# EAGLE design Windsensor5 (EAGLE 5.07)
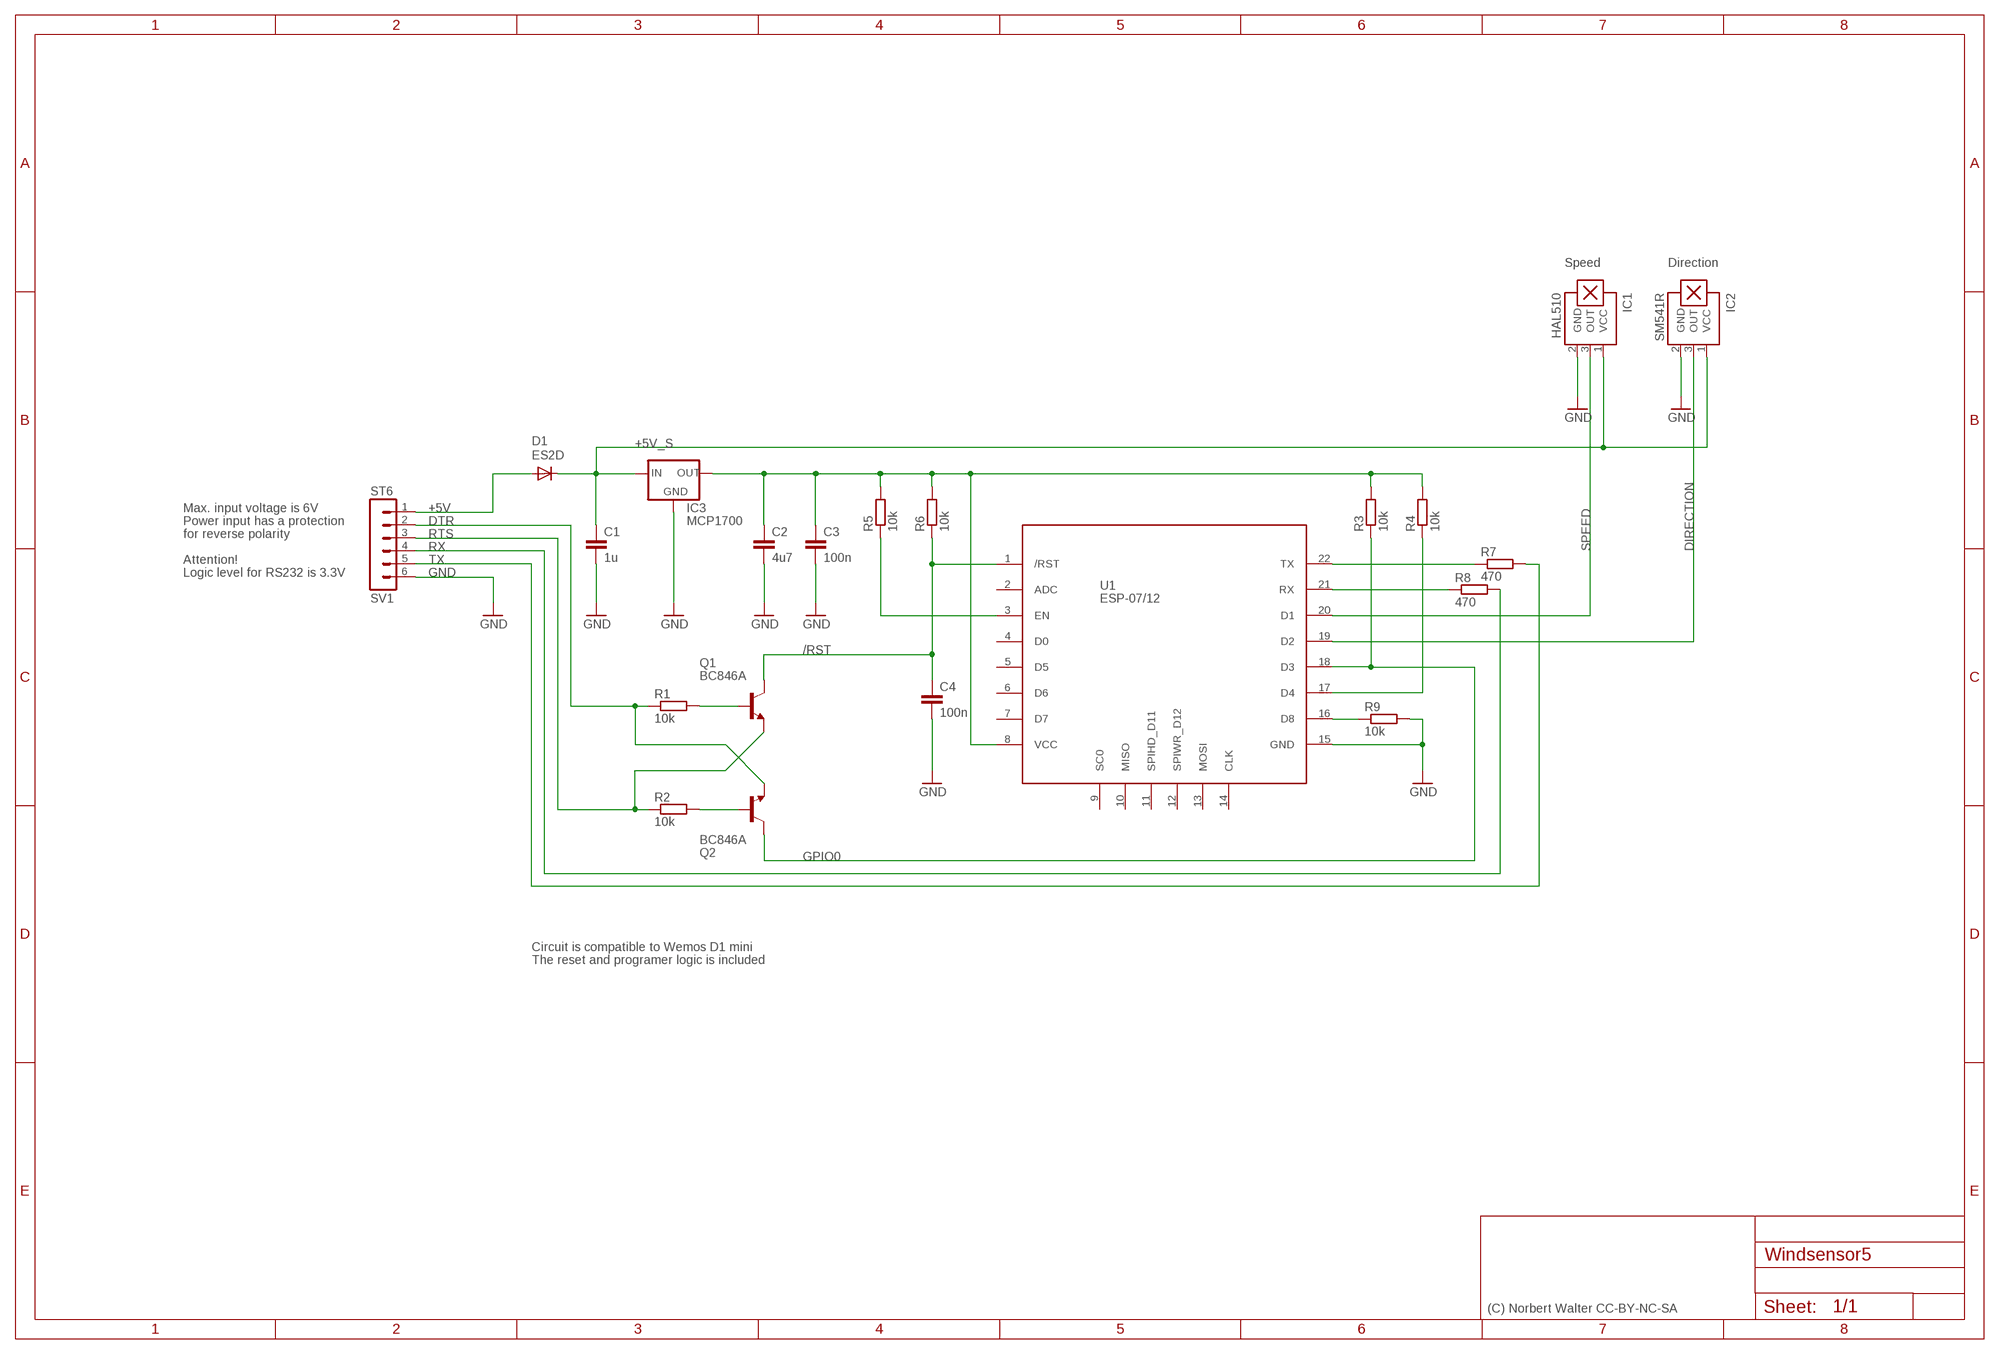
[diagram p0: schematic, sheet 1]

## Parts
C1  1u  C-EUC0805  [C0805]
C2  4u7  C-EUC0805  [C0805]
C3  100n  C-EUC0805K  [C0805K]
C4  100n  C-EUC0805K  [C0805K]
D1  ES2D  [SMB]
IC1  HAL510  A1301UA  [SIP3-UA]
IC2  SM541R  [SIP3-UA]
IC3  MCP1700  [SOT223]
Q1  BC846A  BC849SMD  [SOT23-BEC]
Q2  BC846A  BC849SMD  [SOT23-BEC]
R1  10k  R-EU_M0805  [M0805]
R2  10k  R-EU_M0805  [M0805]
R3  10k  R-EU_M0805  [M0805]
R4  10k  R-EU_M0805  [M0805]
R5  10k  R-EU_M0805  [M0805]
R6  10k  R-EU_M0805  [M0805]
R7  470  R-EU_M0805  [M0805]
R8  470  R-EU_M0805  [M0805]
R9  10k  R-EU_M0805  [M0805]
SV1  ST6  MA06-1  [MA06-1]
U1  ESP-07/12  [ESP-07/12]

## Nets
+3.3V: C2.1 C3.1 IC3.3(OUT) R3.2 R4.2 R5.2 R6.2 U1.8(VCC)
+5V: D1.A SV1.1
+5V_S: C1.1 D1.C IC1.1(VCC) IC2.1(VCC) IC3.2(IN)
/RST: C4.1 Q1.C R6.1 U1.1(/RST)
DIRECTION: IC2.3(OUT) U1.19(D2)
DTR: Q2.E R1.1 SV1.2
GND: C1.2 C2.2 C3.2 C4.2 IC1.2(GND) IC2.2(GND) IC3.1(GND) R9.2 SV1.6 U1.15(GND)
GPIO0: Q2.C R3.1 U1.18(D3)
N$4: R5.1 U1.3(EN)
N$5: R9.1 U1.16(D8)
N$6: R8.1 U1.21(RX)
N$7: R7.1 U1.22(TX)
N$8: Q1.B R1.2
N$9: Q2.B R2.2
N$16: R4.1 U1.17(D4)
RTS: Q1.E R2.1 SV1.3
RX: R8.2 SV1.4
SPEED: IC1.3(OUT) U1.20(D1)
TX: R7.2 SV1.5
Unconnected: U1.2(ADC) U1.4(D0) U1.5(D5) U1.6(D6) U1.7(D7) U1.9(SC0) U1.10(MISO) U1.11(SPIHD_D11) U1.12(SPIWR_D12) U1.13(MOSI) U1.14(CLK)

## Notes on the sheet
- Speed | Direction
- Max. input voltage is 6V
- Power input has a protection
- for reverse polarity
- Attention!
- Logic level for RS232 is 3.3V
- Circuit is compatible to Wemos D1 mini
- The reset and programer logic is included
- (C) Norbert Walter CC-BY-NC-SA

## Library data of the parts
C1-C4 = rcl:C-EU: CAPACITOR, European symbol
D1 = diode:ES2D: DIODE super fast rectifier, 2 A
IC1 = allegro:A13*?: Linear Hall Effect Sensor ICs Continuous-Time Ratiometric High-Temperature Operation Programmable Linear with Analog Output A1302 -Replacement- UGN3503 Source: http://www.allegromicro.com/en/Products/Part_Numbers/1301/1301.pdf http://www.allegromicro.com/en/Products/Part_Numbers/1321/1321.pdf http://www.allegromicro.com/en/Products/Part_Numbers/1381/1381.pdf
IC2 = allegro:SM541R
IC3 = v-reg:MCP1700
Q1 Q2 = transistor-npn:BC849*: NPN Transistor
R1-R9 = resistor:R-EU_: RESISTOR, European symbol
SV1 = con-lstb:MA06-1: PIN HEADER
U1 = ESP-12E:ESP-07/12: Version 1.0 of the library for the ESP-07/12 full GPIO dev board module byME Jon jonnyradu@gmail.com

## Board
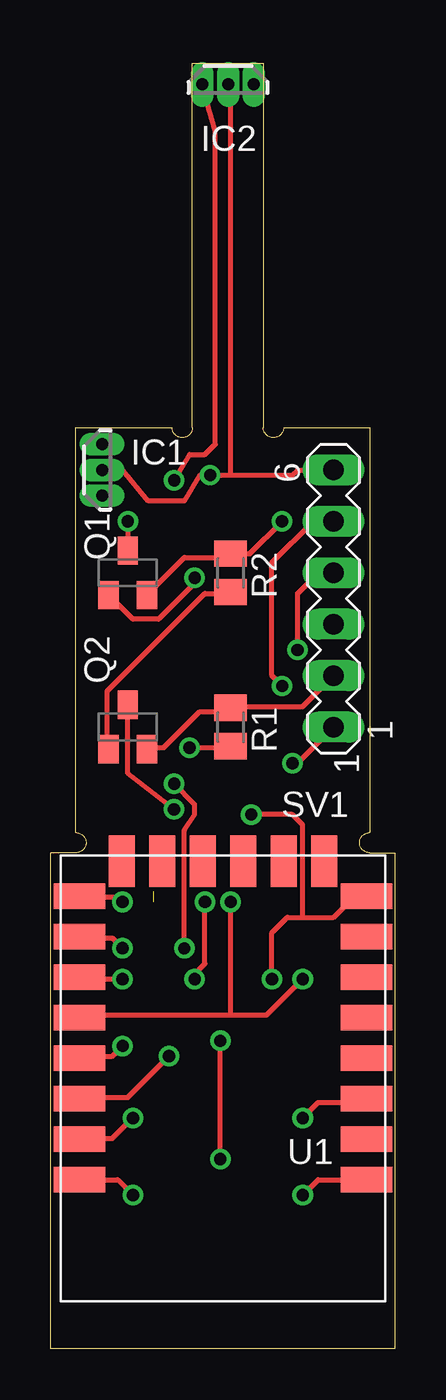
[diagram p1: board, top side]
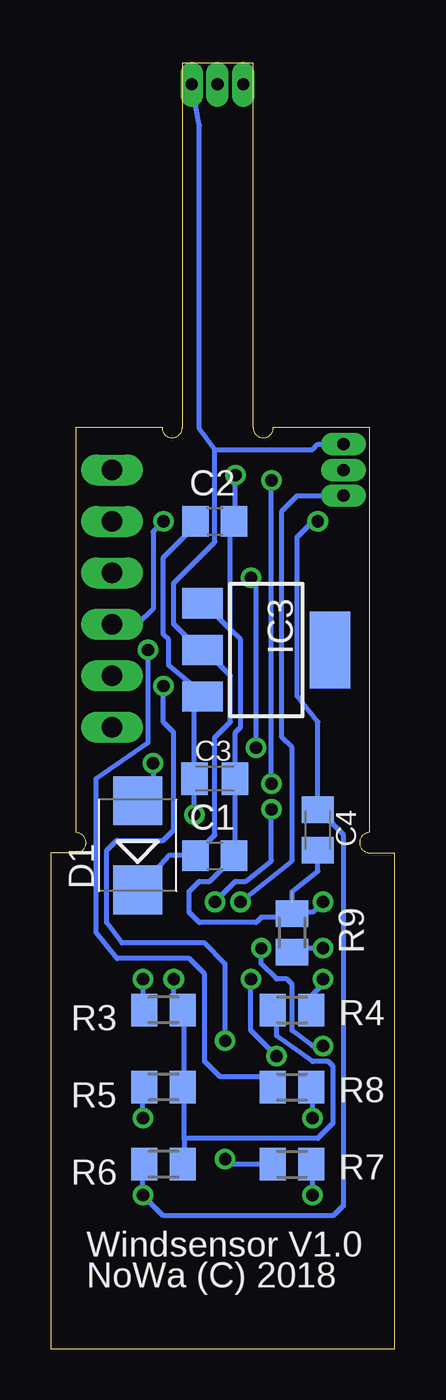
[diagram p2: board, bottom side, seen from below]

Size 17 x 63.5 mm. Coordinates in mm from the lower left corner, seen from the top.
Outline: 0,0 0,24.5 1.25,24.5 arc180 1.25,25.5 1.25,45.5 6,45.5 arc180 7,45.5 7,63.5 10.5,63.5 10.5,45.5 arc180 11.5,45.5 15.75,45.5 15.75,25.5 arc180 15.75,24.5 17,24.5 17,0 0,0
Copper layers (1*16): Top 0.035mm / dielectric 1.5mm / Bottom 0.035mm
Design rules "default *": minimum track width 10mil, minimum drill 24mil, track to track 5mil, track to pad 5mil, pad to pad 5mil, via to via 5mil, smd to smd 5mil, copper to edge 12mil, drill to drill 8mil, minimum pad ring 10mil, minimum via ring 8mil, stop-mask expansion 4mil, vias tented up to drill 0mil, thermal gap 10mil

### Footprints (pad centres in the part's own frame; a part is rotated, then mirrored left to right if it is on the bottom)
C0805 = smd 1.3 x 1.5: 1 -0.95,0; 2 0.95,0
C0805K = smd 1.3 x 1.6: 1 -1,0; 2 1,0
SMB = smd 2.4 x 2.4: A 2.2,0; C -2.2,0
SIP3-UA = drill 0.6 pad 0.7 long: 1 -1.27,0; 2 0,0; 3 1.27,0
SOT223 = smd 1.5 x 2: 1 -2.3,-3.15; 2 0,-3.15; 3 2.3,-3.15 | smd 3.8 x 2: 4 0,3.15
SOT23-BEC = smd 1 x 1.4: B -0.95,-1.1; C 0,1.1; E 0.95,-1.1
M0805 = smd 1.3 x 1.6: 1 -0.95,0; 2 0.95,0
MA06-1 = drill 1.016 long: 1 -6.35,0; 2 -3.81,0; 3 -1.27,0; 4 1.27,0; 5 3.81,0; 6 6.35,0
ESP-07/12 = smd 2.54 x 1.27: 1 -6.715,7.11; 2 -6.715,5.11; 3 -6.715,3.11; 4 -6.715,1.11; 5 -6.715,-0.89; 6 -6.715,-2.89; 7 -6.715,-4.89; 8 -6.715,-6.89; 15 7.475,-6.89; 16 7.475,-4.89; 17 7.475,-2.89; 18 7.475,-0.89; 19 7.475,1.11; 20 7.475,3.11; 21 7.475,5.11; 22 7.475,7.11 | smd 1.27 x 2.54: 9 -4.62,-8.62; 10 -2.62,-8.62; 11 -0.62,-8.62; 12 1.38,-8.62; 13 3.38,-8.62; 14 5.38,-8.62

### Placement (x,y rotation side)
C1  8.89,24.36 0 bottom
C2  8.89,40.87 0 bottom
C3  8.89,28.17 0 bottom
C4  3.81,25.63 270 bottom
D1  12.7,24.87 90 bottom
IC1  2.54,43.41 270 top
IC2  8.76,62.46 180 top
IC3  6.35,34.52 270 bottom
Q1  3.81,38.33 0 top
Q2  3.81,30.71 0 top
R1  8.89,30.71 270 top
R2  8.89,38.33 270 top
R3  11.43,16.74 0 bottom
R4  5.08,16.74 180 bottom
R5  11.43,12.93 0 bottom
R6  11.43,9.12 0 bottom
R7  5.08,9.12 180 bottom
R8  5.08,12.93 180 bottom
R9  5.08,20.55 90 bottom
SV1  13.97,37.06 90 top
U1  8.89,15.47 180 top

### Tracks (layer width: path | path; a pad name or v marks a point on that pad's centre or on a via)
+3.3V  (via drill 0.61)
  Top 0.254: v9.91,26.39 11.94,26.39 12.45,25.88 12.45,21.31 | v10.92,18.26 10.92,20.55 11.68,21.31 12.45,21.31 | U1.8 15.49,22.33 14.99,22.33 13.97,21.31 12.45,21.31
  Bottom 0.254: 9.91,28.17 9.91,31.98 IC3.3 9.65,32.49 11.18,33.76 11.18,35.03 11.43,35.28 11.43,39.09 9.91,40.62 9.91,40.87 C2.1 | 10.41,10.39 3.81,10.39 3.05,11.15 3.05,13.95 3.3,14.2 4.06,14.2 5.84,15.47 5.84,16.74 R4.2 | 10.41,10.39 10.41,9.12 R6.2 | v10.92,18.26 10.92,16.99 10.67,16.74 R3.2 10.41,16.74 10.41,12.93 R5.2 10.41,12.17 10.41,10.39 | v9.91,26.39 9.91,28.17 | 9.91,28.17 C3.1
+5V  (via drill 0.61)
  Top 0.254: v11.94,28.93 12.19,28.93 SV1.1
  Bottom 0.254: v11.94,28.93 11.94,27.92 D1.A
+5V_S
  Bottom 0.254: 9.91,24.36 11.18,24.36 D1.C | 9.91,24.36 8.89,25.38 8.89,30.2 8.13,30.96 8.13,33.25 9.4,34.52 IC3.2 9.65,34.52 10.92,35.79 10.92,37.82 8.89,39.85 8.89,44.43 | C1.1 9.91,24.36 | IC1.1 3.81,44.68 4.06,44.43 8.89,44.43 | 8.89,44.43 9.65,45.44 9.65,60.43 IC2.1
/RST  (via drill 0.61)
  Top 0.254: v12.45,7.6 13.21,8.36 15.49,8.36 U1.1 | v3.81,40.87 Q1.C 3.81,39.35
  Bottom 0.254: R6.1 12.45,9.12 v12.45,7.6 11.43,6.58 3.05,6.58 2.54,7.09 2.54,25.38 3.81,26.65 | v3.81,40.87 4.06,40.87 4.83,40.11 4.83,32.23 3.81,30.96 3.81,26.65 | 3.81,26.65 C4.1
DIRECTION  (via drill 0.6)
  Top 0.254: IC2.3 7.62,62.46 7.62,61.95 8.13,60.17 8.13,44.68 7.62,44.17 6.86,44.17 v6.1,42.9 | U1.19 1.52,14.45 3.05,14.45 v3.56,14.96 | v6.6,19.79 6.6,25.63 7.11,26.39 7.11,26.9 v6.1,27.92
  Bottom 0.254: v3.56,14.96 4.06,14.96 5.08,15.72 5.08,18.01 5.33,18.26 5.84,18.26 6.6,19.03 v6.6,19.79 | v6.1,27.92 v6.1,42.9
DTR
  Top 0.254: Q2.E 4.83,29.69 5.59,29.69 7.37,31.47 8.89,31.47 R1.1 8.89,31.73 12.45,31.73 SV1.2
GND  (via drill 0.6, 0.61)  (1 unrouted)
  Top 0.254: IC1.2 3.56,43.41 4.83,41.89 6.6,41.89 7.37,43.16 v7.87,43.16 8.89,43.16 | 8.89,43.16 8.89,62.46 IC2.2 | 8.89,43.16 11.94,43.16 12.19,43.41 SV1.6 | U1.15 1.52,22.33 3.3,22.33 v3.56,22.07
  Bottom 0.254: C4.2 3.81,23.6 5.08,22.58 R9.2 5.08,21.31 6.6,21.31 6.86,21.06 9.65,21.06 10.16,21.57 10.16,22.58 9.65,23.09 9.14,23.09 7.87,24.36 | v3.56,22.07 4.06,21.57 4.57,21.57 5.08,22.07 | 7.87,24.36 7.87,28.17 | 9.65,37.06 IC3.1 9.4,36.81 8.13,35.54 | 7.87,28.17 7.87,30.46 7.62,30.71 7.62,35.03 8.13,35.54 | 7.87,28.17 C3.2 | 7.87,24.36 C1.2 | 8.13,35.54 8.13,40.87 C2.2 7.87,40.87 v7.87,43.16
GPIO0  (via drill 0.61)
  Top 0.254: v6.1,26.65 3.81,28.42 Q2.C | 8.89,16.49 v8.89,22.07 | v12.45,18.26 10.67,16.49 8.89,16.49 | 8.89,16.49 1.52,16.49 U1.18
  Bottom 0.254: v6.1,26.65 6.1,24.11 7.37,23.09 7.87,23.09 v8.89,22.07 | v12.45,18.26 12.45,16.74 R3.1
N$4  (via drill 0.61)
  Top 0.254: v12.45,11.41 13.21,12.17 15.49,12.17 U1.3
  Bottom 0.254: v12.45,11.41 12.45,12.93 R5.1
N$5  (via drill 0.61)
  Top 0.254: v3.56,19.79 3.05,20.3 1.52,20.3 U1.16
  Bottom 0.254: v3.56,19.79 5.08,19.79 R9.1
N$6  (via drill 0.61)
  Top 0.254: v4.06,11.41 3.05,10.39 1.52,10.39 U1.21
  Bottom 0.254: v4.06,11.41 4.06,12.93 R8.1
N$7  (via drill 0.61)
  Top 0.254: v4.06,7.6 3.3,8.36 1.52,8.36 U1.22
  Bottom 0.254: v4.06,7.6 4.06,9.12 R7.1
N$8  (via drill 0.61)
  Top 0.254: v7.11,38.08 7.11,37.82 5.33,36.04 4.06,36.04 3.05,37.06 Q1.B | v6.86,29.69 8.89,29.69 R1.2
  Bottom 0.254: v7.11,38.08 6.86,37.57 v6.86,29.69
N$9
  Top 0.254: Q2.B 2.79,29.69 2.79,32.49 7.62,37.31 8.89,37.31 R2.2
N$16  (via drill 0.61)
  Top 0.254: v3.56,18.26 1.52,18.26 U1.17
  Bottom 0.254: v3.56,18.26 3.56,18.01 4.06,17.5 4.06,16.74 R4.1
RTS  (via drill 0.61)
  Top 0.254: Q1.E 4.83,37.31 6.6,39.09 8.89,39.09 R2.1 9.84,39.28 v11.43,40.87
  Bottom 0.254: SV1.3 12.7,35.79 11.94,36.55 11.94,40.36 v11.43,40.87
RX  (via drill 0.61)
  Top 0.254: v12.19,34.52 12.19,37.31 13.21,38.33 SV1.4
  Bottom 0.254: v12.19,34.52 12.19,29.95 14.75,28.16 14.75,20.56 13.72,19.28 10.16,19.28 9.4,18.52 9.4,14.2 8.64,13.44 6.1,13.44 6.1,12.93 R8.2
SPEED  (via drill 0.61)
  Top 0.254: v7.11,18.26 7.11,18.52 7.62,19.03 v7.62,22.07 | v5.84,14.45 3.81,12.42 1.52,12.42 U1.20
  Bottom 0.254: IC1.3 4.83,42.14 5.59,41.38 5.59,30.2 5.08,29.69 5.08,24.11 v7.62,22.07 | v7.11,18.26 7.11,15.72 v5.84,14.45
TX  (via drill 0.6)
  Top 0.254: SV1.5 12.95,40.87 10.92,38.84 10.92,33.25 v11.43,32.74 | v8.38,9.37 v8.38,15.22
  Bottom 0.254: R7.2 8.13,9.12 v8.38,9.37 | v8.38,15.22 8.38,19.03 9.4,20.04 13.47,20.04 14.23,21.06 14.23,24.61 13.72,25.12 11.43,25.12 10.92,25.63 10.92,30.46 11.43,30.96 v11.43,32.74

### Text on the board
tNames: 1
bNames: Windsensor V1.0 | NoWa (C) 2018